# EAGLE design CBMKeyboard (EAGLE 6.5.0)
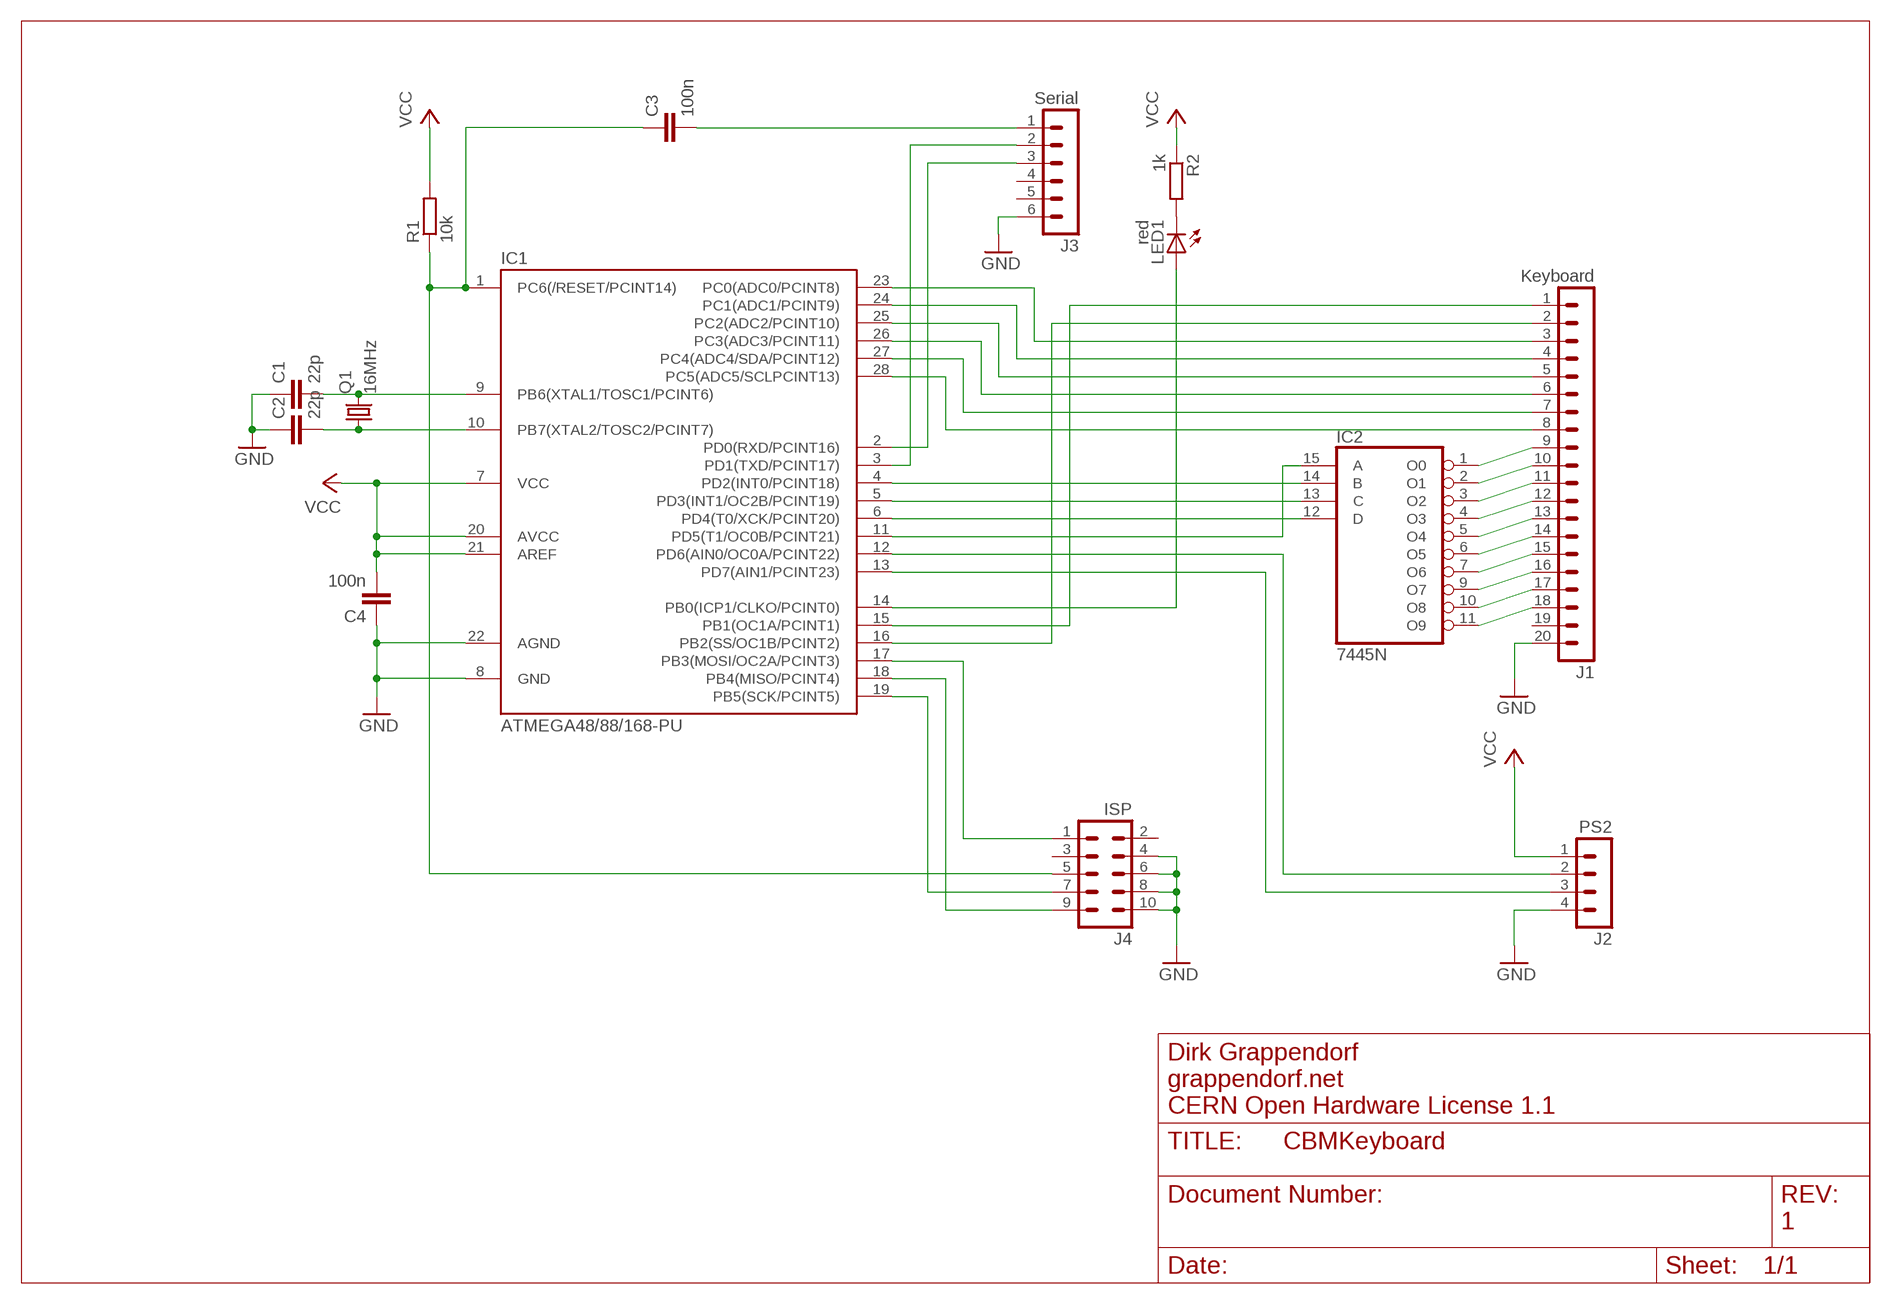
[diagram p0: schematic, sheet 1]

## Parts
C1  22p  C2.5/2  [C2.5-2]
C2  22p  C2.5/2  [C2.5-2]
C3  100n  C-EU050-025X075  [C050-025X075]
C4  100n  C2.5/2  [C2.5-2]
IC1  ATMEGA48/88/168-PU  [DIL28-3]
IC2  7445N  [DIL16]
J1  Keyboard  MA20-1  [MA20-1]
J2  PS2  MA04-1  [MA04-1]
J3  Serial  MA06-1  [MA06-1]
J4  ISP  ML10  [ML10]
LED1  red  LED3MM  [LED3MM]
Q1  16MHz  CRYSTALHC49S  [HC49/S]
R1  10k  R-EU_0207/7  [0207/7]
R2  1k  R-EU_0207/7  [0207/7]

## Nets
GND: C1.1 C2.1 C4.1 IC1.8(GND) IC1.22(AGND) J1.20 J2.4 J3.6 J4.4 J4.6 J4.8 J4.10
N$1: IC1.17(PB3(MOSI/OC2A/PCINT3)) J4.1
N$2: IC1.19(PB5(SCK/PCINT5)) J4.7
N$3: IC1.4(PD2(INT0/PCINT18)) IC2.14(B)
N$4: C3.1 IC1.1(PC6(/RESET/PCINT14)) J4.5 R1.1
N$5: IC2.1(O0) J1.9
N$6: IC2.2(O1) J1.10
N$7: IC2.3(O2) J1.11
N$8: IC2.4(O3) J1.12
N$9: IC2.5(O4) J1.13
N$10: IC2.6(O5) J1.14
N$11: IC2.7(O6) J1.15
N$12: IC2.9(O7) J1.16
N$13: IC2.10(O8) J1.17
N$14: IC2.11(O9) J1.18
N$15: IC1.3(PD1(TXD/PCINT17)) J3.2
N$16: IC1.2(PD0(RXD/PCINT16)) J3.3
N$17: IC1.28(PC5(ADC5/SCLPCINT13)) J1.8
N$18: IC1.5(PD3(INT1/OC2B/PCINT19)) IC2.13(C)
N$19: IC1.27(PC4(ADC4/SDA/PCINT12)) J1.7
N$20: IC1.26(PC3(ADC3/PCINT11)) J1.6
N$21: IC1.25(PC2(ADC2/PCINT10)) J1.5
N$22: IC1.24(PC1(ADC1/PCINT9)) J1.4
N$23: C1.2 IC1.9(PB6(XTAL1/TOSC1/PCINT6)) Q1.2
N$24: C2.2 IC1.10(PB7(XTAL2/TOSC2/PCINT7)) Q1.1
N$25: IC1.23(PC0(ADC0/PCINT8)) J1.3
N$26: IC1.16(PB2(SS/OC1B/PCINT2)) J1.2
N$27: IC1.15(PB1(OC1A/PCINT1)) J1.1
N$28: C3.2 J3.1
N$29: IC1.6(PD4(T0/XCK/PCINT20)) IC2.12(D)
N$30: IC1.11(PD5(T1/OC0B/PCINT21)) IC2.15(A)
N$31: IC1.12(PD6(AIN0/OC0A/PCINT22)) J2.2
N$32: IC1.13(PD7(AIN1/PCINT23)) J2.3
N$33: LED1.K(C) R2.2
N$34: IC1.18(PB4(MISO/PCINT4)) J4.9
N$35: IC1.14(PB0(ICP1/CLKO/PCINT0)) LED1.A
VCC: C4.2 IC1.7(VCC) IC1.20(AVCC) IC1.21(AREF) J2.1 R1.2 R2.1
Unconnected: J1.19 J3.4 J3.5 J4.2 J4.3

## Notes on the sheet
- Dirk Grappendorf
- grappendorf.net
- CERN Open Hardware License 1.1
- 1

## Power pins joined to a net without a drawn wire
GND: IC2.8(GND)
VCC: IC2.16(VCC)

## Library data of the parts
C1 C2 C4 = capacitor-wima:C: CAPACITOR naming: grid - package width
C3 = rcl:C-EU: CAPACITOR, European symbol
IC1 = atmega8:ATMEGA48/88/168-PU
IC2 = 74xx-eu:74*45: BCD to decimal DECODER/DRIVER
J1 = con-lstb:MA20-1: PIN HEADER
J2 = con-lstb:MA04-1: PIN HEADER
J3 = con-lstb:MA06-1: PIN HEADER
J4 = con-ml:ML10: HARTING
LED1 = led:LED: LED OSRAM: - CHIPLED LG R971, LG N971, LY N971, LG Q971, LY Q971, LO R971, LY R971 LH N974, LH R974 LS Q976, LO Q976, LY Q976 LO Q996 - Hyper CHIPLED LW Q18S LB Q993, LB Q99A, LB R99A - SideLED LS A670, LO A670, LY A670, LG A670, LP A670 LB A673, LV A673, LT A673, LW A673 LH A674 LY A675 LS A676, LA A676, LO A676, LY A676, LW A676 LS A679, LY A679, LG A679 - Hyper Micro SIDELED® LS Y876, LA Y876, LO Y876, LY Y876 LT Y87S - SmartLED LW L88C, LW L88S LB L89C, LB L89S, LG L890 LS L89K, LO L89K, LY L89K LS L896, LA L896, LO L896, LY L896 - TOPLED LS T670, LO T670, LY T670, LG T670, LP T670 LSG T670, LSP T670, LSY T670, LOP T670, LYG T670 LG T671, LOG T671, LSG T671 LB T673, LV T673, LT T673, LW T673 LH T674 LS T676, LA T676, LO T676, LY T676, LB T676, LH T676, LSB T676, LW T676 LB T67C, LV T67C, LT T67C, LS T67K, LO T67K, LY T67K, LW E67C LS E67B, LA E67B, LO E67B, LY E67B, LB E67C, LV E67C, LT E67C LW T67C LS T679, LY T679, LG T679 LS T770, LO T770, LY T770, LG T770, LP T770 LB T773, LV T773, LT T773, LW T773 LH T774 LS E675, LA E675, LY E675, LS T675 LS T776, LA T776, LO T776, LY T776, LB T776 LHGB T686 LT T68C, LB T68C - Hyper Mini TOPLED® LB M676 - Mini TOPLED Santana® LG M470 LS M47K, LO M47K, LY M47K Source: http://www.osram.convergy.de LUXEON: - LUMILED® LXK2-PW12-R00, LXK2-PW12-S00, LXK2-PW14-U00, LXK2-PW14-V00 LXK2-PM12-R00, LXK2-PM12-S00, LXK2-PM14-U00 LXK2-PE12-Q00, LXK2-PE12-R00, LXK2-PE12-S00, LXK2-PE14-T00, LXK2-PE14-U00 LXK2-PB12-K00, LXK2-PB12-L00, LXK2-PB12-M00, LXK2-PB14-N00, LXK2-PB14-P00, LXK2-PB14-Q00 LXK2-PR12-L00, LXK2-PR12-M00, LXK2-PR14-Q00, LXK2-PR14-R00 LXK2-PD12-Q00, LXK2-PD12-R00, LXK2-PD12-S00 LXK2-PH12-R00, LXK2-PH12-S00 LXK2-PL12-P00, LXK2-PL12-Q00, LXK2-PL12-R00 Source: www.luxeon.com KINGBRIGHT: KA-3528ASYC Source: www.kingbright.com
Q1 = crystal:CRYSTAL: CRYSTAL
R1 R2 = rcl:R-EU_: RESISTOR, European symbol

## Board
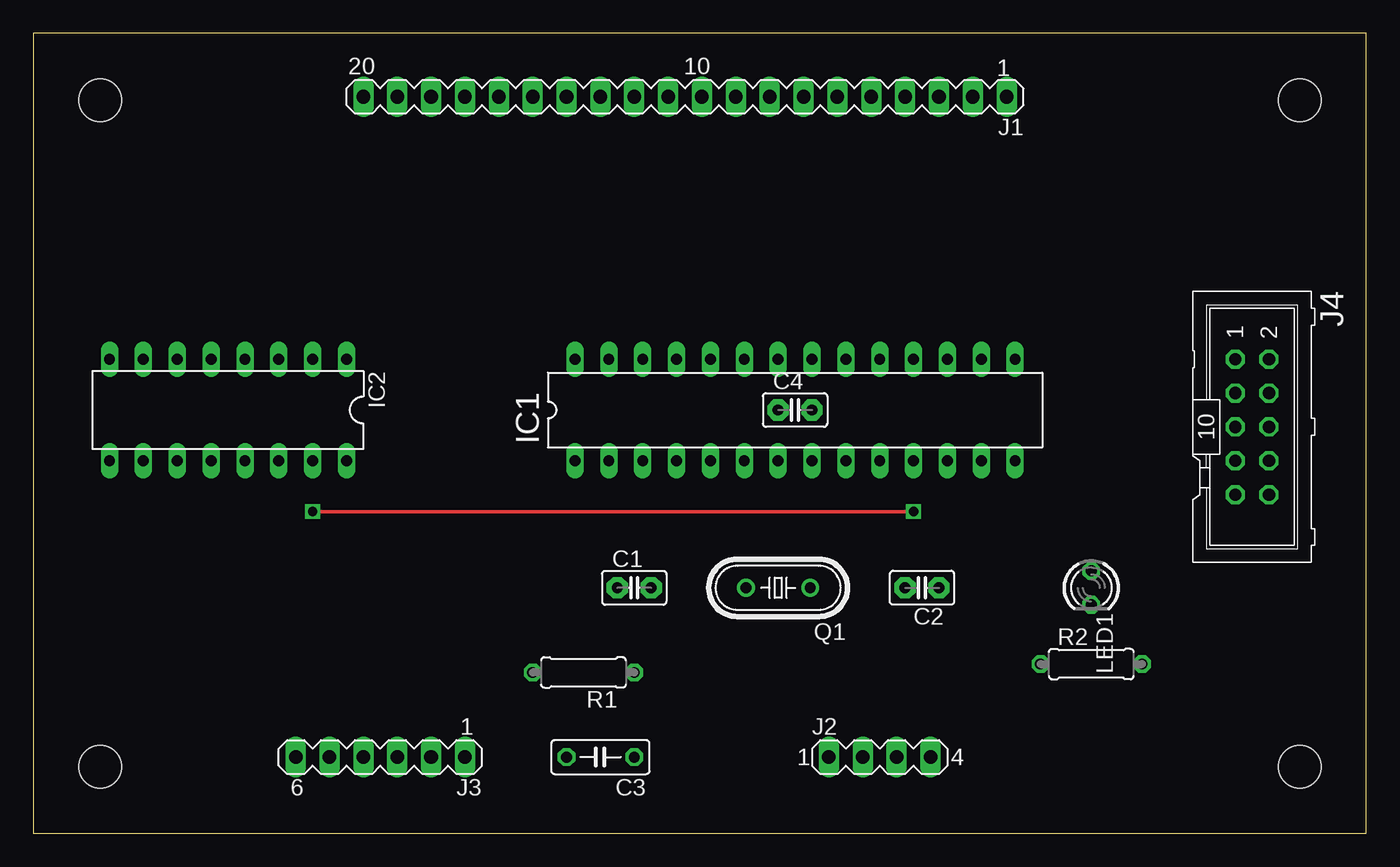
[diagram p1: board, top side]
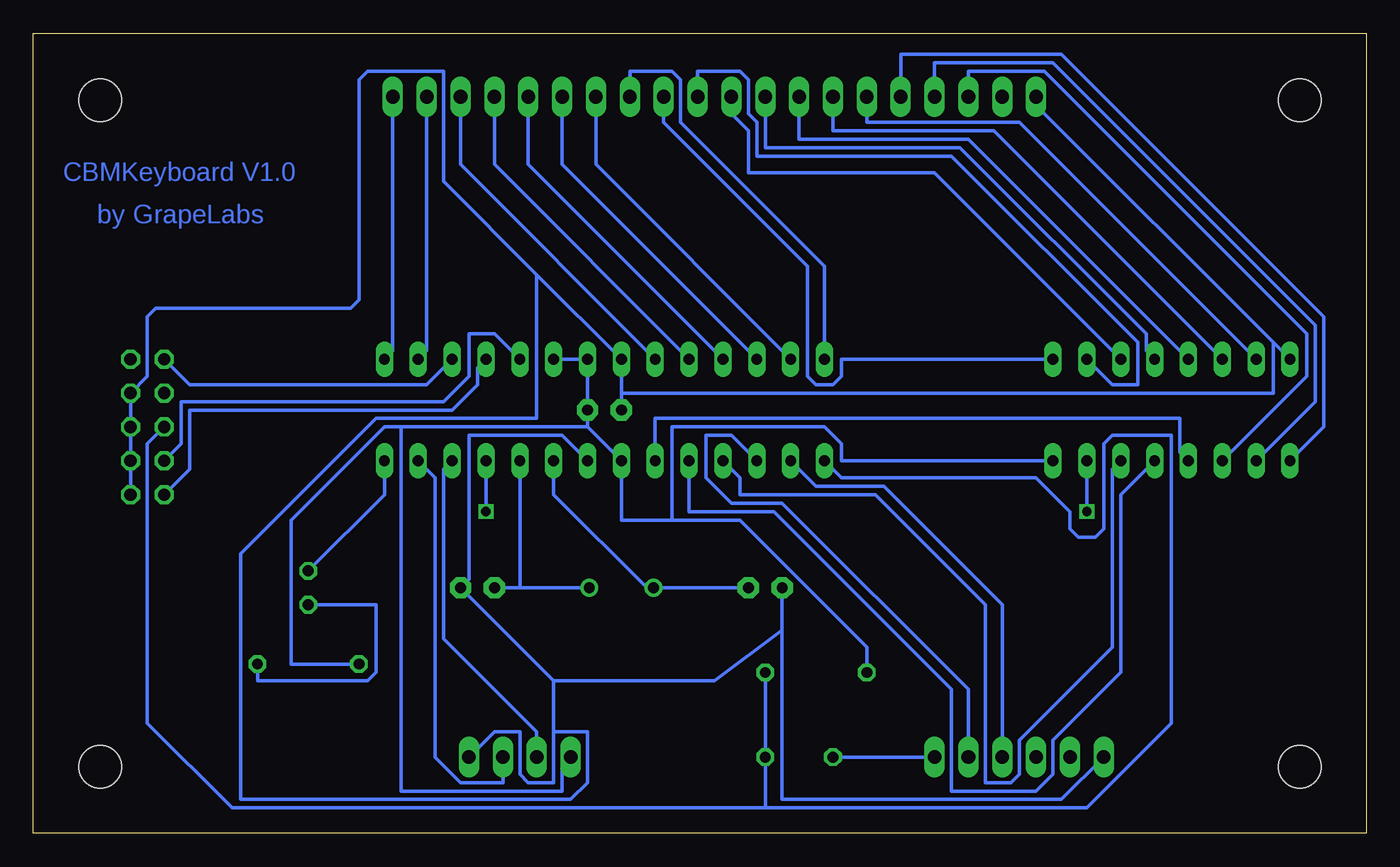
[diagram p2: board, bottom side, seen from below]

Size 100 x 60 mm. Coordinates in mm from the lower left corner, seen from the top.
Outline: 0,0 100,0 100,60 0,60 0,0
Copper layers (1*16): Top 0.035mm / dielectric 1.5mm / Bottom 0.035mm
Design rules "default *": minimum track width 10mil, minimum drill 24mil, track to track 8mil, track to pad 8mil, pad to pad 8mil, via to via 8mil, smd to smd 8mil, copper to edge 0mil, drill to drill 8mil, minimum pad ring 10mil, minimum via ring 8mil, stop-mask expansion 4mil, vias tented up to drill 0mil, thermal gap 10mil
Holes 3.2 mm at 5,55 5,5 95,5 95,55

### Footprints (pad centres in the part's own frame; a part is rotated, then mirrored left to right if it is on the bottom)
C2.5-2 = drill 0.813 pad 1.6 octagon: 1 -1.27,0; 2 1.27,0
C050-025X075 = drill 0.813 octagon: 1 -2.54,0; 2 2.54,0
DIL28-3 = drill 0.813 long: 1 -16.51,-3.81; 2 -13.97,-3.81; 3 -11.43,-3.81; 4 -8.89,-3.81; 5 -6.35,-3.81; 6 -3.81,-3.81; 7 -1.27,-3.81; 8 1.27,-3.81; 9 3.81,-3.81; 10 6.35,-3.81; 11 8.89,-3.81; 12 11.43,-3.81; 13 13.97,-3.81; 14 16.51,-3.81; 15 16.51,3.81; 16 13.97,3.81; 17 11.43,3.81; 18 8.89,3.81; 19 6.35,3.81; 20 3.81,3.81; 21 1.27,3.81; 22 -1.27,3.81; 23 -3.81,3.81; 24 -6.35,3.81; 25 -8.89,3.81; 26 -11.43,3.81; 27 -13.97,3.81; 28 -16.51,3.81
DIL16 = drill 0.813 long: 1 -8.89,-3.81; 2 -6.35,-3.81; 3 -3.81,-3.81; 4 -1.27,-3.81; 5 1.27,-3.81; 6 3.81,-3.81; 7 6.35,-3.81; 8 8.89,-3.81; 9 8.89,3.81; 10 6.35,3.81; 11 3.81,3.81; 12 1.27,3.81; 13 -1.27,3.81; 14 -3.81,3.81; 15 -6.35,3.81; 16 -8.89,3.81
MA20-1 = drill 1.016 long: 1 -24.13,0; 2 -21.59,0; 3 -19.05,0; 4 -16.51,0; 5 -13.97,0; 6 -11.43,0; 7 -8.89,0; 8 -6.35,0; 9 -3.81,0; 10 -1.27,0; 11 1.27,0; 12 3.81,0; 13 6.35,0; 14 8.89,0; 15 11.43,0; 16 13.97,0; 17 16.51,0; 18 19.05,0; 19 21.59,0; 20 24.13,0
MA04-1 = drill 1.016 long: 1 -3.81,0; 2 -1.27,0; 3 1.27,0; 4 3.81,0
MA06-1 = drill 1.016 long: 1 -6.35,0; 2 -3.81,0; 3 -1.27,0; 4 1.27,0; 5 3.81,0; 6 6.35,0
ML10 = drill 0.914 octagon: 1 -5.08,-1.27; 2 -5.08,1.27; 3 -2.54,-1.27; 4 -2.54,1.27; 5 0,-1.27; 6 0,1.27; 7 2.54,-1.27; 8 2.54,1.27; 9 5.08,-1.27; 10 5.08,1.27
LED3MM = drill 0.813 octagon: A -1.27,0; K 1.27,0
HC49/S = drill 0.813 round: 1 -2.413,0; 2 2.413,0
0207/7 = drill 0.813 octagon: 1 -3.81,0; 2 3.81,0

### Placement (x,y rotation side)
C1  45.09,18.41 0 top
C2  66.67,18.41 180 top
C3  42.55,5.71 180 top
C4  57.15,31.75 0 top
IC1  57.15,31.75 0 top
IC2  14.61,31.75 180 top
J1  48.9,55.24 180 top
J2  63.5,5.71 0 top
J3  26.04,5.71 180 top
J4  91.44,30.48 270 top
LED1  79.38,18.41 270 top
Q1  55.88,18.41 180 top
R1  41.27,12.06 180 top
R2  79.38,12.7 0 top

### Tracks (layer width: path | path; a pad name or v marks a point on that pad's centre or on a via)
GND
  Bottom 0.254: IC1.8 60.33,29.84 67.31,29.84 67.31,19.05 C2.1 60.96,11.43 | J2.4 65.41,7.62 63.5,7.62 63.5,4.45 62.87,3.81 60.96,3.81 60.96,7.62 | 60.96,11.43 60.96,7.62 | J3.6 22.86,2.54 43.81,2.54 43.81,15.24 | 43.81,15.24 C1.1 | 60.96,11.43 48.9,11.43 43.81,15.24 | J4.4 J4.6 J4.8 J4.10 J4.4 | 55.88,33.02 C4.1 | 55.88,33.02 IC1.22 62.23,41.91 | 6.99,36.83 24.77,54.61 J1.20 | 6.99,36.83 IC2.8 | 55.88,33.02 6.99,33.02 6.99,36.83 | 62.23,41.91 69.22,48.9 69.22,57.15 74.93,57.15 75.56,56.52 75.56,40.01 76.2,39.37 90.81,39.37 91.44,38.73 91.44,34.29 J4.4 | 60.96,7.62 58.42,7.62 58.42,3.81 59.69,2.54 84.45,2.54 84.45,20.95 74.3,31.11 62.23,31.11 62.23,41.91
N$1
  Bottom 0.254: IC1.17 70.48,33.66 88.27,33.66 J4.1
N$2
  Bottom 0.254: IC1.19 65.41,37.47 67.31,37.47 67.31,34.29 69.22,32.38 88.9,32.38 88.9,29.21 J4.7
N$3
  Bottom 0.254: IC2.14 19.05,27.3 19.05,13.97 26.04,6.99 26.04,4.45 26.67,3.81 28.57,3.81 28.57,17.14 36.83,25.4 46.99,25.4 46.99,26.67 IC1.4
N$4
  Bottom 0.254: R1.1 C3.1 45.09,1.91 | IC1.1 39.37,26.67 24.77,26.67 22.23,24.13 22.23,22.86 21.59,22.23 20.32,22.23 19.68,22.86 19.68,29.21 19.05,29.84 14.61,29.84 14.61,8.26 20.95,1.91 45.09,1.91 | J4.5 91.44,29.21 91.44,8.26 85.09,1.91 45.09,1.91
N$5
  Bottom 0.254: IC2.1 39.37,35.56 39.37,34.29 40.01,33.66 41.27,33.66 41.91,34.29 41.91,42.55 52.7,53.34 J1.9
N$6
  Bottom 0.254: IC2.2 19.05,33.66 17.14,33.66 17.14,36.83 31.11,50.8 45.72,50.8 45.72,53.34 46.35,53.98 46.35,56.52 46.99,57.15 50.16,57.15 J1.10
N$7
  Bottom 0.254: IC2.3 32.38,49.53 46.35,49.53 46.35,52.7 47.62,53.98 J1.11
N$8
  Bottom 0.254: IC2.4 16.51,36.2 16.51,37.47 30.48,51.44 45.09,51.44 J1.12
N$9
  Bottom 0.254: IC2.5 29.84,52.07 42.55,52.07 J1.13
N$10
  Bottom 0.254: J1.14 40.01,52.7 27.94,52.7 IC2.6
N$11
  Bottom 0.254: J1.15 37.47,53.34 26.04,53.34 IC2.7
N$12
  Bottom 0.254: IC2.9 3.17,30.48 3.17,38.73 22.86,58.42 34.92,58.42 J1.16
N$13
  Bottom 0.254: IC2.10 3.81,32.38 3.81,38.1 23.5,57.78 32.38,57.78 J1.17
N$14
  Bottom 0.254: IC2.11 4.45,34.29 4.45,37.47 24.13,57.15 29.84,57.15 J1.18
N$15
  Bottom 0.254: IC1.3 47.62,29.84 49.53,29.84 49.53,26.67 47.62,24.77 43.81,24.77 29.84,10.79 J3.2
N$16
  Bottom 0.254: IC1.2 41.27,26.04 36.2,26.04 27.3,17.14 J3.3
N$17
  Bottom 0.254: J1.8 55.24,57.15 52.07,57.15 51.44,56.52 51.44,53.34 40.64,42.55 IC1.28
N$18
  Bottom 0.254: IC2.13 18.41,25.4 18.41,12.06 23.5,6.99 23.5,4.45 24.77,3.17 31.11,3.17 31.11,10.79 44.45,24.13 50.8,24.13 IC1.5
N$19
  Bottom 0.254: IC1.27 57.78,50.16 J1.7
N$20
  Bottom 0.254: IC1.26 60.33,50.16 J1.6
N$21
  Bottom 0.254: IC1.25 62.87,50.16 J1.5
N$22
  Bottom 0.254: IC1.24 65.41,50.16 J1.4
N$23
  Bottom 0.254: C1.2 Q1.2 53.98,18.41 60.96,25.4 IC1.9
N$24
  Bottom 0.254: 63.5,18.41 C2.2 | Q1.1 63.5,18.41 | 63.5,18.41 IC1.10
N$25
  Bottom 0.254: IC1.23 67.94,50.16 J1.3
N$26
  Bottom 0.254: IC1.16 70.48,36.2 J1.2
N$27
  Bottom 0.254: IC1.15 73.03,36.2 J1.1
N$28
  Bottom 0.254: J3.1 C3.2
N$29
  Bottom 0.254: IC2.12 13.97,28.57 13.97,31.11 53.34,31.11 IC1.6
N$30  (via drill 0.7)
  Top 0.254: v20.95,24.13 v66.04,24.13
  Bottom 0.254: v20.95,24.13 IC2.15 | v66.04,24.13 IC1.11
N$31
  Bottom 0.254: IC1.12 69.22,27.3 69.22,14.61 62.23,7.62 J2.2
N$32
  Bottom 0.254: IC1.13 69.85,26.67 69.85,5.71 67.94,3.81 64.77,3.81 J2.3
N$33
  Bottom 0.254: LED1.K 74.3,17.14 74.3,12.06 74.93,11.43 83.19,11.43 R2.2
N$34
  Bottom 0.254: IC1.18 66.67,34.92 66.67,33.66 68.58,31.75 88.27,31.75 88.27,27.3 J4.9
N$35
  Bottom 0.254: LED1.A 73.66,25.4 IC1.14
VCC
  Bottom 0.254: R1.2 37.47,13.97 46.99,23.5 52.07,23.5 | 52.07,23.5 55.88,23.5 IC1.7 58.42,30.48 | IC2.16 39.37,27.94 39.37,29.21 40.64,30.48 52.07,30.48 52.07,23.5 | IC1.20 IC1.21 C4.2 58.42,30.48 | R2.1 80.64,12.7 80.64,23.5 73.66,30.48 72.39,30.48 | 58.42,30.48 72.39,30.48 | J2.1 60.33,5.08 60.33,3.17 72.39,3.17 72.39,30.48

### Text on the board
Bottom: CBMKeyboard V1.0 | by GrapeLabs
Artwork: CBMKeyboard V1.0 | by GrapeLabs